# EAGLE design dcdc0210 (EAGLE 9.6.2)
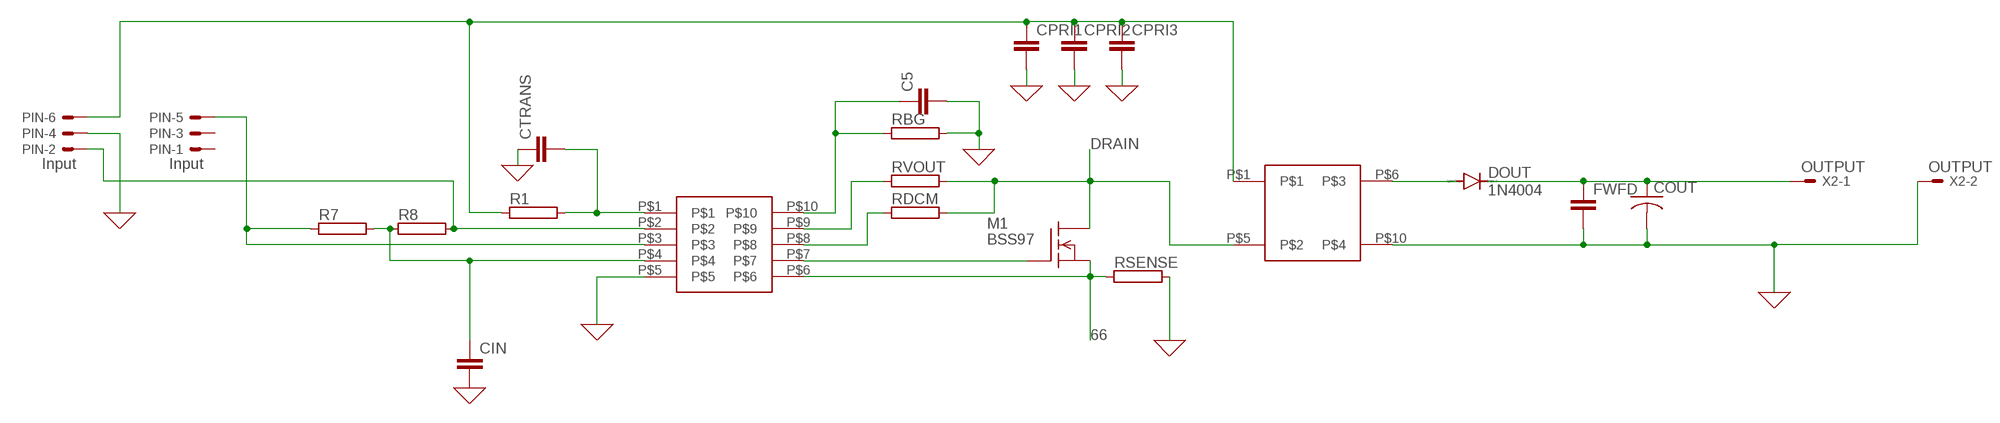
[diagram p0: schematic, sheet 1]

## Parts
C5  C5/3.5  [C5B3.5]
CIN  C5/3.5  [C5B3.5]
COUT  C-US050-050X075  [C050-050X075]
CPRI1  C5/3.5  [C5B3.5]
CPRI2  C5/3.5  [C5B3.5]
CPRI3  C5/3.5  [C5B3.5]
CTRANS  C5/3.5  [C5B3.5]
DOUT  1N4004  [DO41-10]
FWFD  C5/3.5  [C5B3.5]
M1  BSS97  [TO202]
PIN  Input  332-06  [332-06]
R1  RAC01  [AC01]
R7  RAC01  [AC01]
R8  RAC01  [AC01]
RBG  RAC01  [AC01]
RDCM  RAC01  [AC01]
RSENSE  RAC01  [AC01]
RVOUT  RAC01  [AC01]
U$1  LT3750  [LT3750]
U$2  32052  [32052]
X2  OUTPUT  332-02  [332-02]

## Nets
0: C5.2 CIN.2 COUT.2 CPRI1.2 CPRI2.2 CPRI3.2 CTRANS.1 FWFD.2 PIN.4 RBG.2 RSENSE.2 U$1.P$5 U$2.P$10 X2.2 ; supply symbol labelled GND
66: M1.1(S) RSENSE.1 U$1.P$6
DRAIN: M1.2(D) RDCM.2 RVOUT.2 U$2.P$5
N$1: CIN.1 R7.2 R8.1 U$1.P$4
N$2: C5.1 RBG.1 U$1.P$10
N$3: RVOUT.1 U$1.P$9
N$4: RDCM.1 U$1.P$8
N$6: M1.3(G) U$1.P$7
N$8: PIN.2 R8.2 U$1.P$2
N$9: DOUT.A U$2.P$6
N$10: COUT.1 DOUT.C FWFD.1 X2.1
N$13: CPRI1.1 CPRI2.1 CPRI3.1 PIN.6 R1.1 U$2.P$1
N$14: CTRANS.2 R1.2 U$1.P$1
N$15: PIN.5 R7.1 U$1.P$3
Unconnected: PIN.1 PIN.3

## Library data of the parts
C5 CIN CPRI1-CPRI3 CTRANS FWFD = capacitor-wima:C: CAPACITOR naming: grid - package width
COUT = rcl:C-US: CAPACITOR, American symbol; SPICEPREFIX: C
DOUT = diode:1N4004: DIODE general purpose rectifier, 1 A
M1 = transistor-fet:BSS97: N-Channel Enhancement MOSFET 200V; 1.5A; 1,6Ohm
PIN = con-garry:332-06: 6 Pin - 2mm Dual Row Source: www.mpe-connector.de / garry_shortform_2012.pdf
R1 R7 R8 RBG RDCM RSENSE RVOUT = resistor-power:R: Power Resitor; OC_FARNELL: unknown; OC_NEWARK: unknown
U$1 = boostTest1215:LT3750
U$2 = boostTest1215:32052
X2 = con-garry:332-02: 2 Pin - 2mm Dual Row Source: www.mpe-connector.de / garry_shortform_2012.pdf

## Net classes
0 default: width 0.8 mm, drill 0.25 mm

## Board
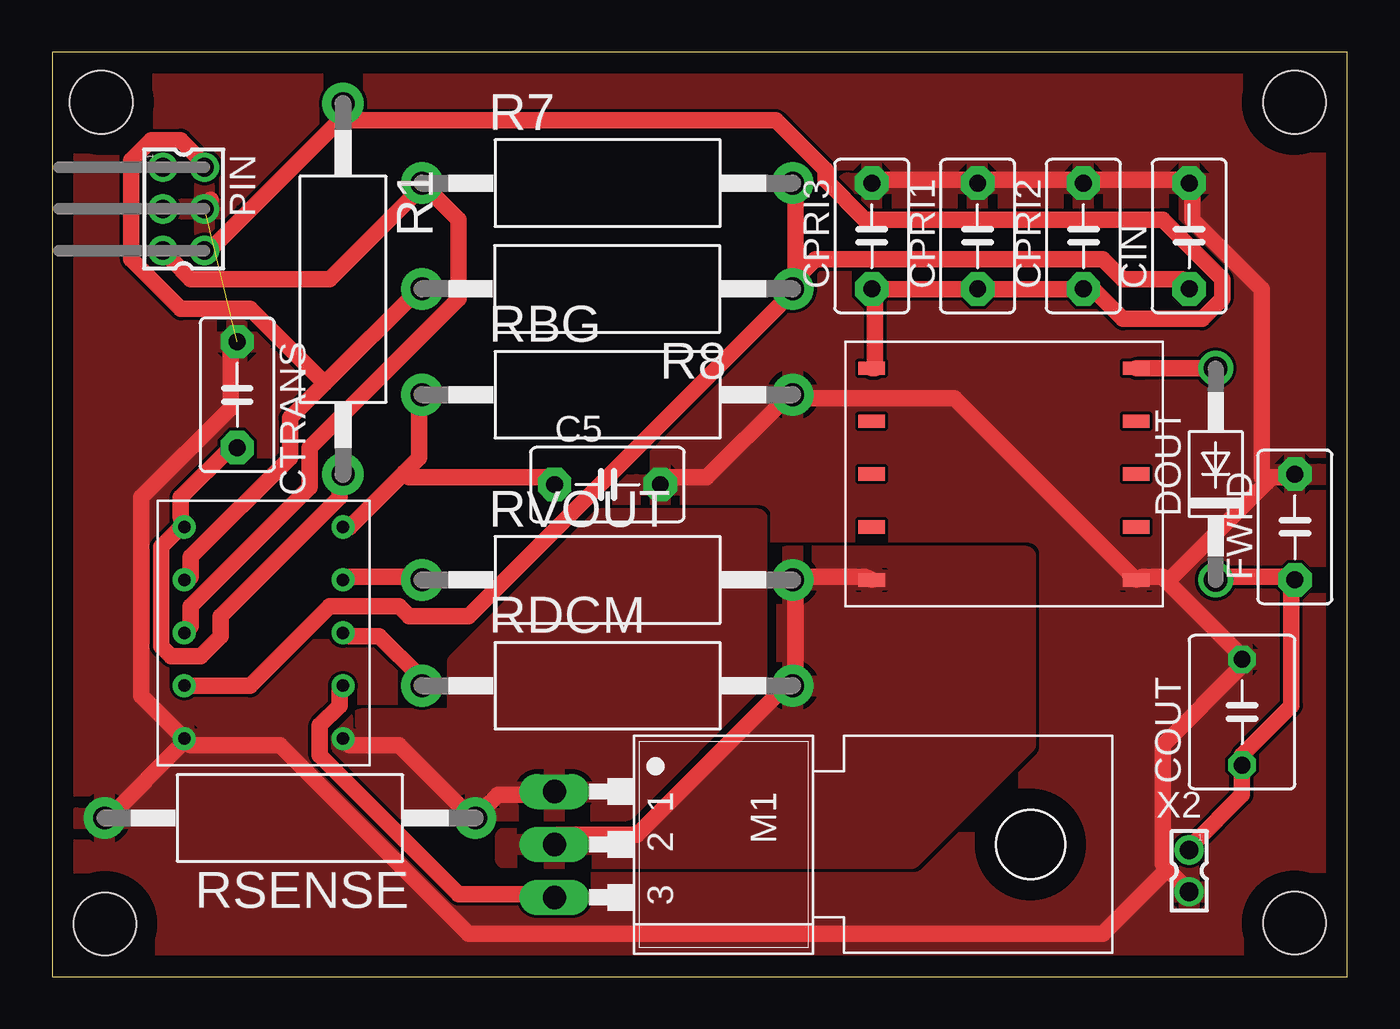
[diagram p1: board, top side]

Size 62.21 x 44.39 mm. Coordinates in mm from the lower left corner, seen from the top.
Outline: 0,0 62.21,0 62.21,44.39 0,44.39 0,0
Copper layers (1*16): Top 0.035mm / dielectric 1.5mm / Bottom 0.035mm
Design rules "default": minimum track width 6mil, minimum drill 0.35mm, track to track 6mil, track to pad 6mil, pad to pad 6mil, via to via 6mil, smd to smd 6mil, copper to edge 40mil, drill to drill 6mil, minimum pad ring 10mil, minimum via ring 8mil, stop-mask expansion 4mil, vias tented up to drill 0mil, thermal gap 10mil
Holes 3 mm at 2.54,2.54 59.66,2.58 59.66,41.98 2.36,41.98

### Footprints (pad centres in the part's own frame; a part is rotated, then mirrored left to right if it is on the bottom)
C5B3.5 = drill 0.813 pad 1.6 octagon: 1 -2.54,0; 2 2.54,0
C050-050X075 = drill 0.813 octagon: 1 -2.54,0; 2 2.54,0
DO41-10 = drill 1.118: A 5.08,0; C -5.08,0
TO202 = drill 1.118 long: 1 -2.54,-5.08; 2 0,-5.08; 3 2.54,-5.08 | hole 3.302: 0,17.78
332-06 = drill 0.9 pad 1.27: 1 -2,-1; 2 -2,1; 3 0,-1; 4 0,1; 5 2,-1; 6 2,1
AC01 = drill 1.1 pad 2: 1 -8.9,0; 2 8.9,0
LT3750 = drill 0.6: P$1 0,12.7; P$2 0,10.16; P$3 0,7.62; P$4 0,5.08; P$5 0,2.54; P$6 7.62,2.54; P$7 7.62,5.08; P$8 7.62,7.62; P$9 7.62,10.16; P$10 7.62,12.7
32052 = smd 1.27 x 0.635: P$1 1.27,11.43; P$2 1.27,8.89; P$3 1.27,6.35; P$4 1.27,3.81; P$5 1.27,1.27; P$6 13.97,11.43; P$7 13.97,8.89; P$8 13.97,6.35; P$9 13.97,3.81; P$10 13.97,1.27
332-02 = drill 0.9 pad 1.27: 1 0,-1; 2 0,1

### Placement (x,y rotation side)
C5  26.67,23.63 0 top
CIN  54.61,35.56 90 top
COUT  57.15,12.7 90 top
CPRI1  44.45,35.56 90 top
CPRI2  49.53,35.56 90 top
CPRI3  39.37,35.56 90 top
CTRANS  8.89,27.94 270 top
DOUT  55.88,24.13 90 top
FWFD  59.69,21.59 90 top
M1  29.21,6.35 270 top
PIN  6.32,36.86 270 top
R1  13.97,33.02 270 top
R7  26.67,38.1 0 top
R8  26.67,33.02 180 top
RBG  26.67,27.94 0 top
RDCM  26.67,13.97 0 top
RSENSE  11.43,7.62 180 top
RVOUT  26.67,19.05 0 top
U$1  6.35,8.89 0 top
U$2  38.1,17.78 0 top
X2  54.61,5.08 180 top

### Tracks (layer width: path | path; a pad name or v marks a point on that pad's centre or on a via)
0  (1 unrouted)
  Top 0.8: 7.62,37.3 PIN.4 | 39.05,38.25 CPRI3.2 39.52,38.25 44.28,38.25 CPRI1.2 44.76,38.25 49.52,38.25 CPRI2.2 50,38.25 54.29,38.25 CIN.2 54.76,37.78 54.76,36.35 58.09,33.01 58.09,23.97 58.33,23.73 | U$1.P$5 6.19,11.11 2.86,7.78 RSENSE.2 | CTRANS.1 8.57,30.16 8.57,27.3 4.28,23.01 4.28,13.49 6.19,11.59 U$1.P$5 | C5.2 29.52,23.97 31.43,23.97 35.24,27.78 RBG.2 35.71,27.78 43.33,27.78 51.9,19.2 U$2.P$10 52.38,19.2 53.33,19.2 53.57,18.97 | 53.57,18.97 57.14,15.4 COUT.2 57.14,14.92 53.33,11.11 53.33,5.39 53.57,5.16 | 53.57,5.16 54.29,4.44 X2.2 | 53.57,18.97 58.33,23.73 | 58.33,23.73 58.57,23.97 59.52,23.97 FWFD.2 | 53.57,5.16 50.48,2.06 20,2.06 10.95,11.11 6.67,11.11 U$1.P$5
  pour Top (rank 3): -0.64,44.98 -0.64,-0.92 -0.54,-1.02 62.86,-1.02 63.06,-0.82 63.06,44.88 62.86,45.08 -0.74,45.08
66
  Top 0.8: U$1.P$6 14.28,11.11 16.66,11.11 20,7.78 RSENSE.1 20.48,7.78 21.43,8.73 23.81,8.73 M1.1
  pour Top: 13.86,11.08 16.96,7.98 27.56,7.98 33.86,14.28 33.86,21.98 26.36,21.98 19.46,15.08 19.46,12.38 15.26,12.38 14.86,12.38 13.86,11.38
DRAIN
  Top 0.8: U$2.P$5 39.05,19.2 35.71,19.2 RVOUT.2 35.71,18.73 35.71,14.44 RDCM.2 35.24,13.97 28.09,6.82 24.28,6.82 M1.2
  pour Top (rank 2): 21.76,5.68 41.26,5.68 46.76,11.18 46.76,20.18 35.26,20.18 35.26,14.18 35.26,13.68 28.76,7.18 28.26,6.68 21.76,6.68
N$1
  Top 0.8: U$1.P$4 6.67,13.97 9.52,13.97 13.33,17.78 16.66,17.78 17.14,17.3 20,17.3 35.71,33.01 R8.1 | CIN.1 54.29,33.49 51.43,33.49 50.48,34.44 36.67,34.44 35.71,33.49 R8.1 | R7.2 35.71,37.78 35.71,33.97 R8.1
N$2
  Top 0.8: 16.9,24.2 17.62,24.92 17.62,27.78 RBG.1 | 16.9,24.2 14.28,21.59 U$1.P$10 | C5.1 23.81,23.97 17.14,23.97 16.9,24.2
N$3
  Top 0.8: U$1.P$9 14.28,19.2 17.62,19.2 RVOUT.1
N$4
  Top 0.8: U$1.P$8 14.28,16.35 15.71,16.35 17.62,14.44 RDCM.1
N$6
  Top 0.8: U$1.P$7 13.81,13.97 13.81,13.01 12.86,12.06 12.86,10.63 19.52,3.97 23.81,3.97 M1.3
N$8
  Top 0.8: 13.09,28.49 17.62,33.01 R8.2 | 13.09,28.49 11.43,26.82 11.43,24.92 6.67,20.16 6.67,19.2 U$1.P$2 | 13.09,28.49 9.52,32.06 6.19,32.06 3.81,34.44 3.81,39.2 4.76,40.16 6.19,40.16 7.14,39.2 PIN.2
N$9
  Top 0.8: U$2.P$6 52.38,29.2 55.71,29.2 DOUT.A
N$10
  Top 0.8: DOUT.C 56.19,19.2 59.52,19.2 FWFD.1 59.52,18.73 59.52,13.01 57.14,10.63 COUT.1 57.14,8.73 54.76,6.35 X2.1
N$13
  Top 0.8: 39.52,33.01 39.52,29.2 U$2.P$1 | 39.52,33.01 44.28,33.01 CPRI1.1 44.76,33.01 CPRI2.1 50,33.01 51.43,31.59 55.24,31.59 56.19,32.54 56.19,33.49 53.33,36.35 39.05,36.35 37.14,38.25 37.14,38.73 34.76,41.11 14.28,41.11 R1.1 14.28,41.59 7.62,34.92 PIN.6 | 39.52,33.01 CPRI3.1
N$14
  Top 0.8: CTRANS.2 8.57,25.4 6.19,23.01 6.19,22.06 U$1.P$1 6.19,21.59 5.24,20.63 5.24,15.87 5.71,15.4 7.14,15.4 8.09,16.35 8.09,17.3 13.81,23.01 13.81,23.97 R1.2
N$15
  Top 0.8: U$1.P$3 6.67,16.82 6.67,17.78 12.38,23.49 12.38,25.4 19.52,32.54 19.52,36.35 18.09,37.78 R7.1 17.62,37.78 13.33,33.49 6.67,33.49 5.71,34.44 PIN.5